# EAGLE design step_motor (EAGLE 6.5.0)
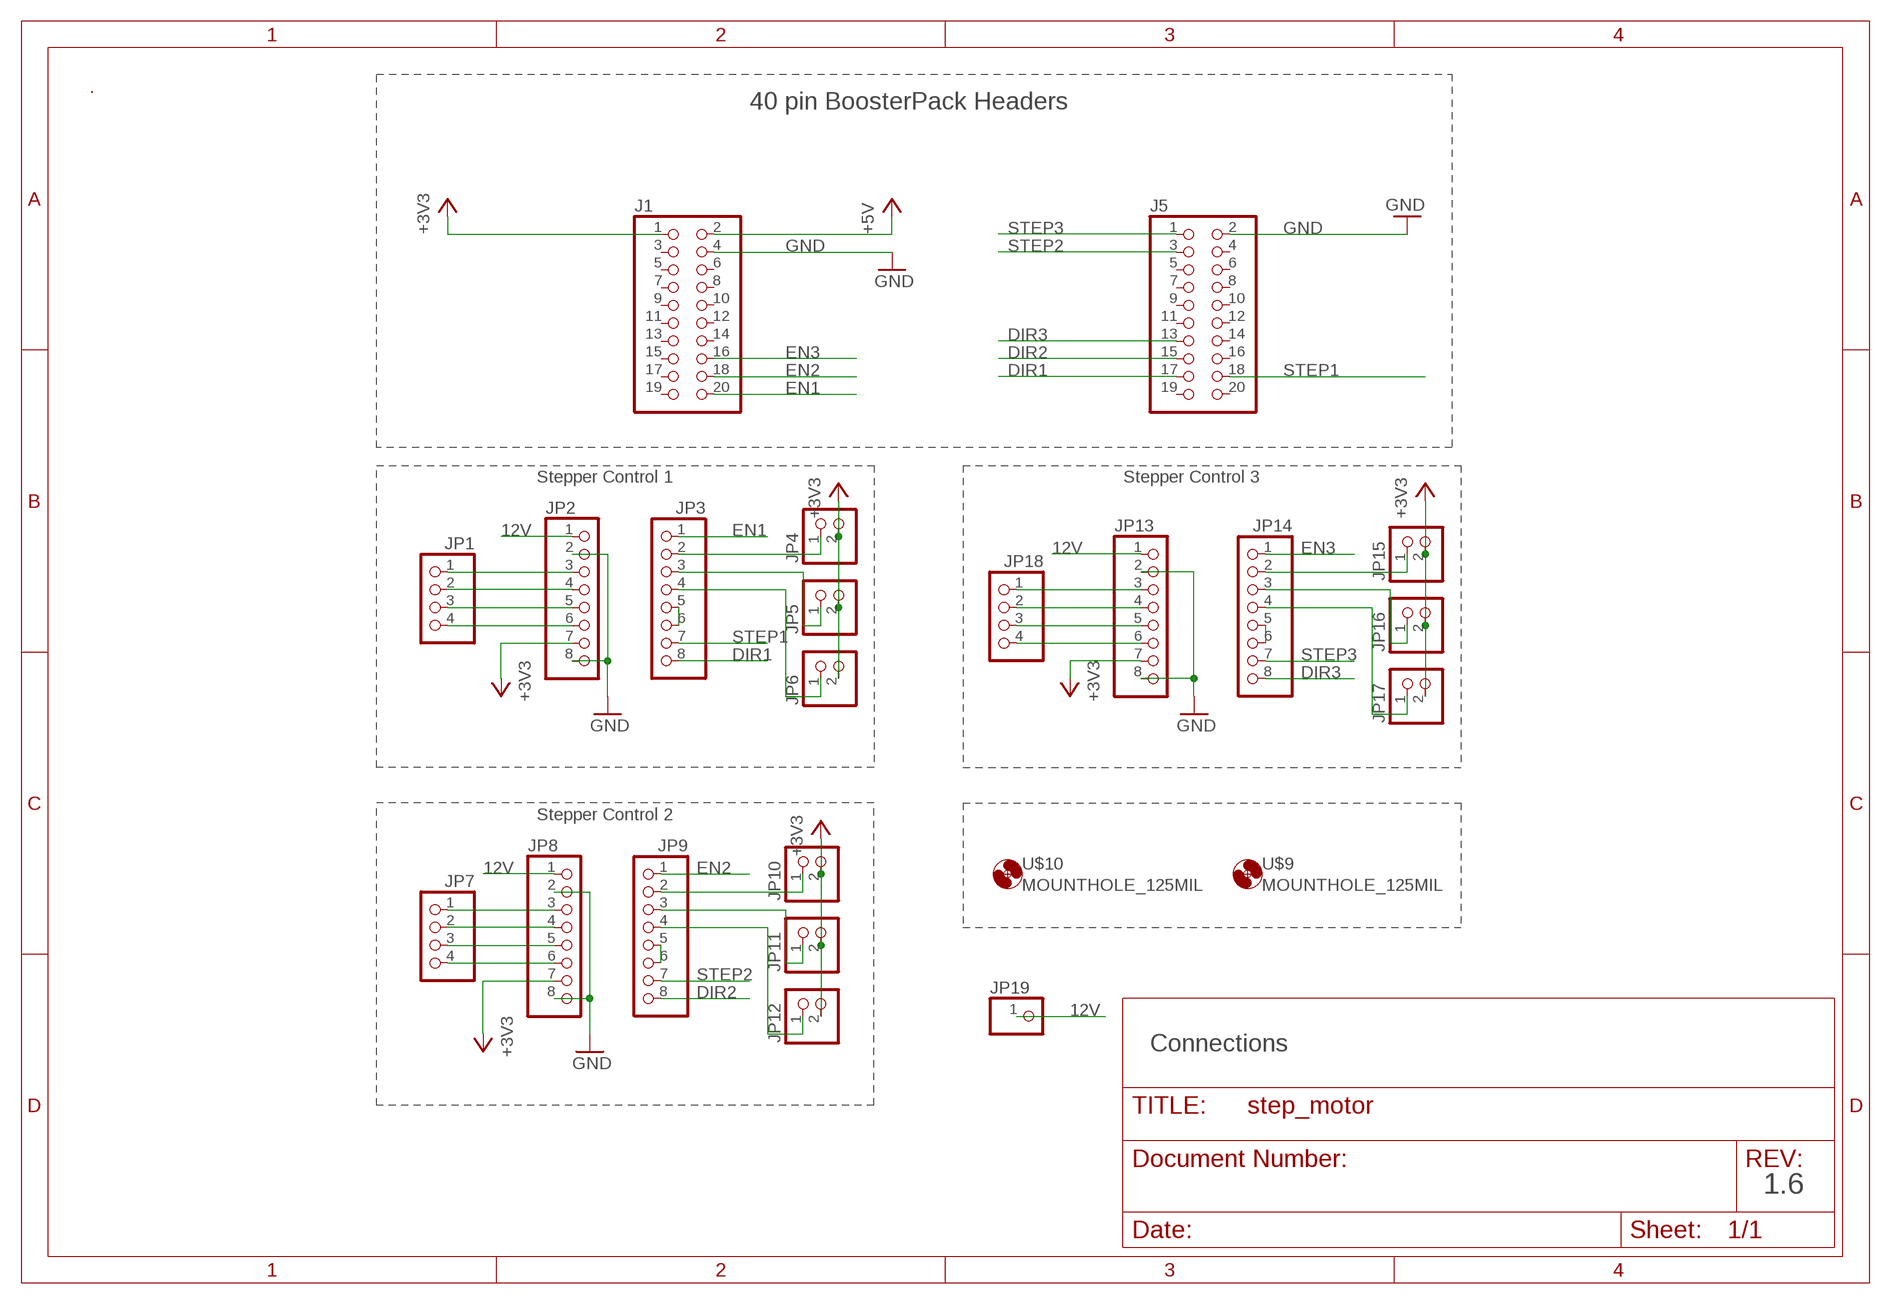
[diagram p0: schematic, sheet 1]

## Parts
J1  PINHD-2X10  [2X10]
J5  PINHD-2X10  [2X10]
JP1  PINHD-1X4  [1X04]
JP2  PINHD-1X8  [1X08]
JP3  PINHD-1X8  [1X08]
JP4  PINHD-1X2  [1X02]
JP5  PINHD-1X2  [1X02]
JP6  PINHD-1X2  [1X02]
JP7  PINHD-1X4  [1X04]
JP8  PINHD-1X8  [1X08]
JP9  PINHD-1X8  [1X08]
JP10  PINHD-1X2  [1X02]
JP11  PINHD-1X2  [1X02]
JP12  PINHD-1X2  [1X02]
JP13  PINHD-1X8  [1X08]
JP14  PINHD-1X8  [1X08]
JP15  PINHD-1X2  [1X02]
JP16  PINHD-1X2  [1X02]
JP17  PINHD-1X2  [1X02]
JP18  PINHD-1X4  [1X04]
JP19  PINHD-1X1  [1X01]
U$4  MS_TM  [MS_TM]
U$9  MOUNTHOLE_125MIL  [MOUNTHOLE_125MIL]
U$10  MOUNTHOLE_125MIL  [MOUNTHOLE_125MIL]

## Nets
12V: JP2.1 JP8.1 JP13.1 JP19.1
+5V [Power]: J1.2
DIR1: J5.17 JP3.8
DIR2: J5.15 JP9.8
DIR3: J5.13 JP14.8
EN1: J1.20 JP3.1
EN2: J1.18 JP9.1
EN3: J1.16 JP14.1
GND [Ground]: J1.4 J5.2 JP2.2 JP2.8 JP8.2 JP8.8 JP13.2 JP13.8
N$1: JP1.1 JP2.3
N$2: JP1.2 JP2.4
N$3: JP1.3 JP2.5
N$4: JP1.4 JP2.6
N$5: JP3.5 JP3.6
N$6: JP3.2 JP4.1
N$7: JP3.3 JP5.1
N$8: JP3.4 JP6.1
N$10: JP9.2 JP10.1
N$11: JP9.3 JP11.1
N$12: JP9.4 JP12.1
N$13: JP7.1 JP8.3
N$14: JP7.2 JP8.4
N$15: JP9.5 JP9.6
N$16: JP7.3 JP8.5
N$17: JP7.4 JP8.6
N$18: JP14.2 JP15.1
N$19: JP14.3 JP16.1
N$20: JP14.4 JP17.1
N$28: JP14.5 JP14.6
N$31: JP13.3 JP18.1
N$32: JP13.4 JP18.2
N$35: JP13.5 JP18.3
N$36: JP13.6 JP18.4
STEP1: J5.18 JP3.7
STEP2: J5.3 JP9.7
STEP3: J5.1 JP14.7
VCC2: J1.1 JP2.7 JP4.2 JP5.2 JP6.2 JP8.7 JP10.2 JP11.2 JP12.2 JP13.7 JP15.2 JP16.2 JP17.2 ; supply symbol labelled +3V3
Unconnected: J1.3 J1.5 J1.6 J1.7 J1.8 J1.9 J1.10 J1.11 J1.12 J1.13 J1.14 J1.15 J1.17 J1.19 J5.4 J5.5 J5.6 J5.7 J5.8 J5.9 J5.10 J5.11 J5.12 J5.14 J5.16 J5.19 J5.20

## Notes on the sheet
- 40 pin BoosterPack Headers
- Stepper Control 1 | Stepper Control 3
- Stepper Control 2
- Connections
- 1.6

## Library data of the parts
J1 J5 = pinhead:PINHD-2X10: PIN HEADER
JP1 JP7 JP18 = pinhead:PINHD-1X4: PIN HEADER
JP2 JP3 JP8 JP9 JP13 JP14 = pinhead:PINHD-1X8: PIN HEADER
JP4-JP6 JP10-JP12 JP15-JP17 = pinhead:PINHD-1X2: PIN HEADER
JP19 = pinhead:PINHD-1X1: PIN HEADER
U$4 = LP_Silkscreen:MS_TM
U$9 U$10 = MSP-EXP432:MOUNTHOLE_125MIL

## Net classes
0 Default: width 0.203 mm, drill 0.838 mm, clearance 0.254 mm
1 Ground: width 0.203 mm, drill 0.838 mm, clearance 0.254 mm to class 0, clearance 0.152 mm
2 Power: width 0.381 mm, drill 0.838 mm, clearance 0.254 mm to class 0, clearance 0.152 mm to class 1, clearance 0.152 mm

## Board
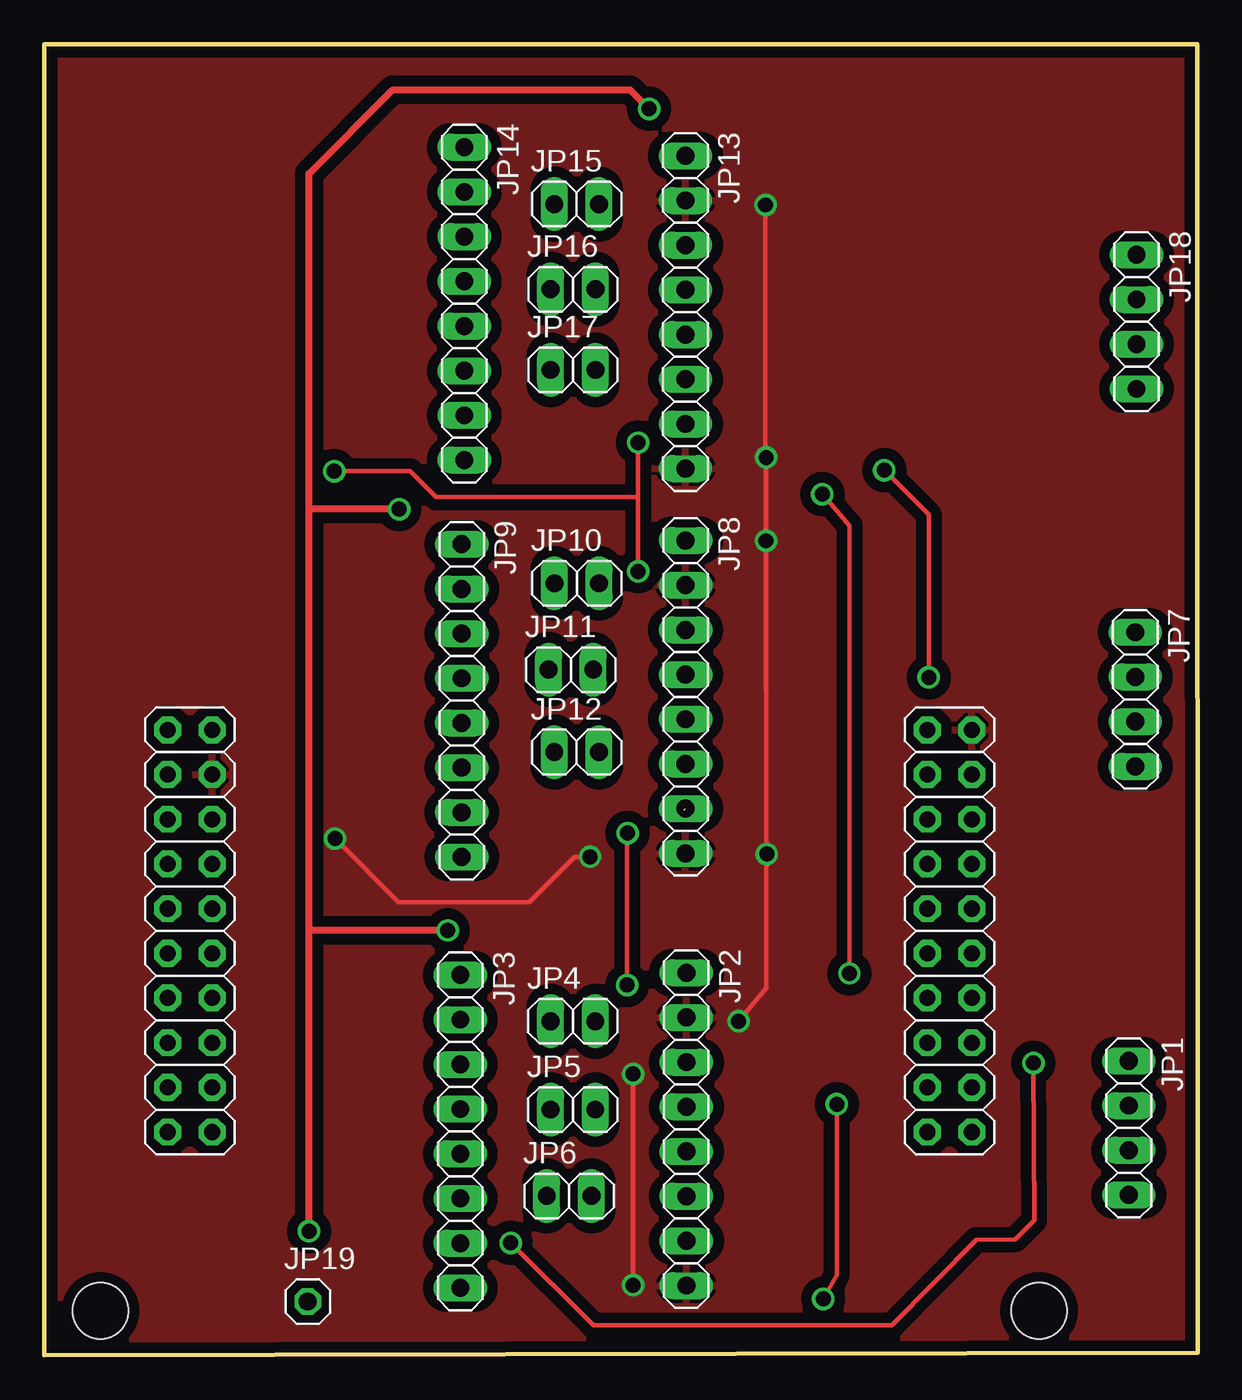
[diagram p1: board, top side]
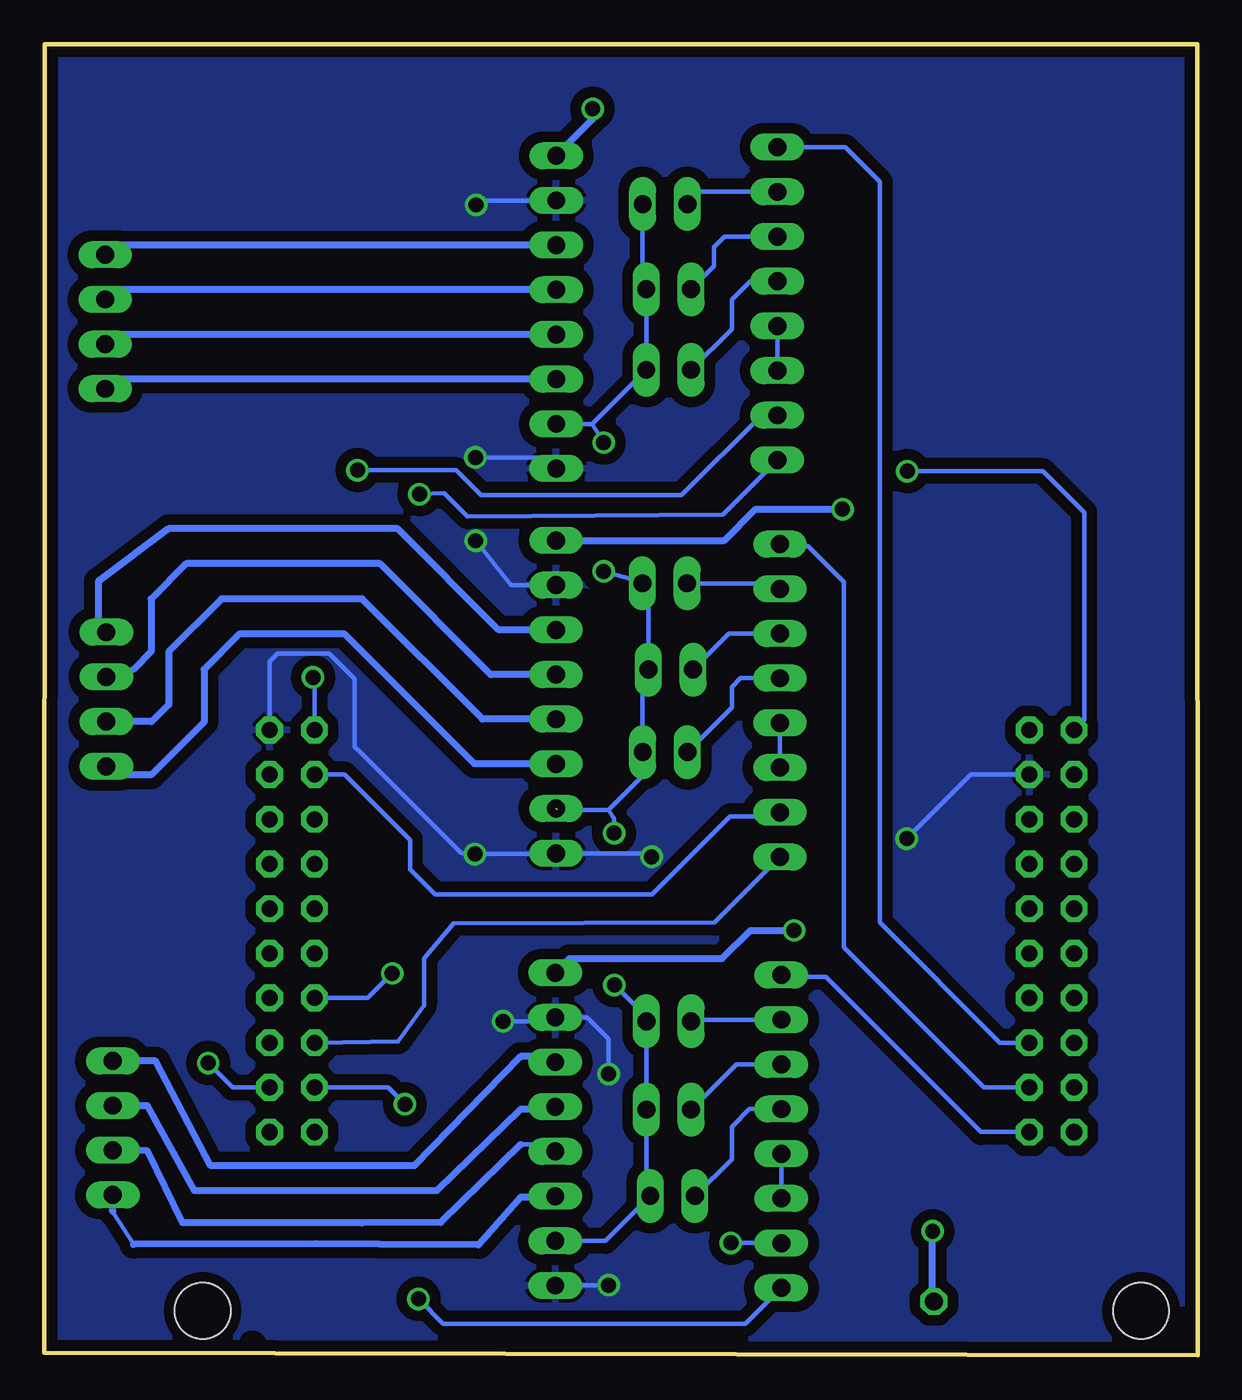
[diagram p2: board, bottom side, seen from below]

Size 65.58 x 74.55 mm. Coordinates in mm from the lower left corner, seen from the top.
Outline: 0.02,74.48 0,0 65.58,0.15 65.55,74.55 0.02,74.55
Copper layers (1*16): Top 0.0178mm / dielectric 12mil / Bottom 0.0178mm
Design rules "default": minimum track width 6mil, minimum drill 12mil, track to track 6mil, track to pad 6mil, pad to pad 6mil, via to via 8mil, smd to smd 6mil, copper to edge 8mil, drill to drill 8mil, minimum pad ring 10mil, minimum via ring 8mil, stop-mask expansion 8mil, vias tented up to drill 15mil, thermal gap 8mil

### Footprints (pad centres in the part's own frame; a part is rotated, then mirrored left to right if it is on the bottom)
2X10 = drill 0.914 pad 1.524 octagon: 1 -11.43,-1.27; 2 -11.43,1.27; 3 -8.89,-1.27; 4 -8.89,1.27; 5 -6.35,-1.27; 6 -6.35,1.27; 7 -3.81,-1.27; 8 -3.81,1.27; 9 -1.27,-1.27; 10 -1.27,1.27; 11 1.27,-1.27; 12 1.27,1.27; 13 3.81,-1.27; 14 3.81,1.27; 15 6.35,-1.27; 16 6.35,1.27; 17 8.89,-1.27; 18 8.89,1.27; 19 11.43,-1.27; 20 11.43,1.27
1X04 = drill 1.016 long: 1 -3.81,0; 2 -1.27,0; 3 1.27,0; 4 3.81,0
1X08 = drill 1.016 long: 1 -8.89,0; 2 -6.35,0; 3 -3.81,0; 4 -1.27,0; 5 1.27,0; 6 3.81,0; 7 6.35,0; 8 8.89,0
1X02 = drill 1.016 long: 1 -1.27,0; 2 1.27,0
1X01 = drill 1.016 octagon: 1 0,0
MOUNTHOLE_125MIL = hole 3.175: 0,0

### Placement (x,y rotation side)
J1  8.29,24.13 270 top
J5  51.47,24.13 270 top
JP1  61.66,12.93 270 top
JP2  36.51,12.86 270 top
JP3  23.67,12.74 270 top
JP4  30.07,19 0 top
JP5  30.07,13.98 0 top
JP6  29.85,9.07 0 top
JP7  62.03,37.3 270 top
JP8  36.47,37.44 270 top
JP9  23.75,37.22 270 top
JP10  30.29,43.89 0 top
JP11  29.95,38.98 0 top
JP12  30.28,34.3 0 top
JP13  36.46,59.3 270 top
JP14  23.89,59.79 270 top
JP15  30.28,65.45 0 top
JP16  30.07,60.6 0 top
JP17  30.07,56.02 0 top
JP18  62.1,58.76 270 top
JP19  15,3.07 0 top
U$4  53.4,0.36 0 top
U$9  56.55,2.54 0 top
U$10  3.21,2.54 0 top

### Tracks (layer width: path | path; a pad name or v marks a point on that pad's centre or on a via)
12V  (via drill 0.85)
  Top 0.406: v15.07,7.07 15.07,24.16 | 15.07,24.16 15.07,48.11 | 15.07,48.11 15.07,67.18 19.82,71.93 33.32,71.93 v34.39,70.86 | v22.95,24.16 15.07,24.16 | v20.19,48.11 15.07,48.11
  Bottom 0.254: JP19.1 15.07,3.14 | JP8.1
  Bottom 0.406: 15.07,3.14 v15.07,7.07 | v34.39,70.86 34.39,70.26 JP13.1 | JP2.1 35.71,22.56 27.03,22.56 25.43,24.16 v22.95,24.16 | JP8.1 26.91,46.33 25.13,48.11 v20.19,48.11
DIR1  (via drill 0.85)
  Top 0.254: v44.29,3.22 45.06,4.58 v45.06,14.29
  Bottom 0.254: JP3.8 25.7,1.81 42.89,1.81 v44.29,3.22 | v45.06,14.29 46.02,15.24 J5.17
DIR2
  Bottom 0.254: JP9.8 27.48,24.61 42.31,24.56 43.98,22.56 43.98,19.9 45.44,17.86 J5.15
DIR3  (via drill 0.85)
  Top 0.254: v44.24,48.96 45.78,47.18 v45.78,21.72
  Bottom 0.254: JP14.8 26.98,47.81 41.5,47.69 42.83,49.02 v44.24,48.96 | v45.78,21.72 47.18,20.32 J5.13
EN1
  Bottom 0.254: J1.20 12.31,12.7 21.13,21.52 23.56,21.52 JP3.1
EN2
  Bottom 0.254: J1.18 12.16,15.24 20.11,23.18 20.11,43.97 22.15,46.01 23.64,46.01 JP9.1
EN3
  Bottom 0.254: J1.16 11.24,17.78 18.06,24.61 18.06,66.71 20.02,68.67 23.88,68.67 JP14.1
GND  (via drill 0.85)
  Top 0.254: v33.48,4 v33.48,16 | v39.48,19 41.07,20.9 41.07,27.9 v41.08,28.5 41.06,29.11 v41.04,46.31 41.04,50.37 v41.05,51.04 41.02,51.89 v41.02,65.4 | v16.54,29.38 20.17,25.76 27.56,25.76 30.15,28.35 v31.04,28.35
  Bottom 0.254: JP2.8 36.49,4 v33.48,4 | v33.48,16 33.48,18 34.7,19.21 JP2.2 36.73,19 v39.48,19 | JP8.2 39.04,43.79 v41.04,46.31 | v41.05,51.04 37.46,51.04 JP13.8 | JP13.2 40.76,65.65 v41.02,65.4 | J5.2 52.74,39.44 52.29,39.9 49.36,39.9 47.92,38.46 47.92,34.6 47.68,34.35 41.87,28.57 v41.08,28.5 36.61,28.5 36.51,28.5 JP8.8 31.24,28.55 v31.04,28.35 | J1.4 12.9,33.02 v16.54,29.38
  pour Bottom (isolate 0.61): 66.15,74.51 66.15,-0.96 -0.2,-1.09 -0.2,74.49
  pour Top (isolate 0.61): 65.66,74.58 65.66,-0.89 0.01,-0.89 0.01,74.41
N$1
  Bottom 0.254: JP2.3 36.84,17
  Bottom 0.406: 36.84,17 38.48,17 44.53,10.79 45.53,10.79 48.1,10.79 56.1,10.79 59.23,16.74 JP1.1
N$2
  Bottom 0.254: JP2.4 36.65,14
  Bottom 0.406: 36.65,14 38.48,14 43.26,9.37 46.26,9.37 49.02,9.37 57.02,9.37 59.69,14.2 JP1.2
N$3
  Bottom 0.254: JP2.5 36.92,12 38.48,12
  Bottom 0.406: 38.48,12 43.02,7.57 47.52,7.54 48.89,7.54 57.71,7.54 59.69,11.62 JP1.3
N$4
  Bottom 0.254: JP2.6 36.57,9 | 60.48,6.32 61.66,8.18
  Bottom 0.406: 36.57,9 38.48,9 40.88,6.28 46.51,6.33 50.12,6.36 60.48,6.32 | 61.66,8.18 JP1.4
N$5
  Bottom 0.254: JP3.5 JP3.6
N$6
  Bottom 0.254: JP3.2 28.8,19.09 JP4.1
N$7
  Bottom 0.254: JP3.3 26.23,16.55 JP5.1
N$8
  Bottom 0.254: JP3.4 25.48,14.01 26.48,13 26.48,11.16 JP6.1
N$10
  Bottom 0.254: JP9.2 24.06,43.89 JP10.1
N$11
  Bottom 0.254: JP9.3 26.63,41.03 JP11.1
N$12
  Bottom 0.254: JP9.4 25.99,38.49 26.48,38 26.48,36.82 JP12.1
N$13
  Bottom 0.254: 62.48,41.56 JP7.1
  Bottom 0.406: JP8.3 39.73,41.25 45.48,47 58.48,47 62.48,44 62.48,41.56
N$14
  Bottom 0.254: 60.48,39 61.6,39
  Bottom 0.406: JP8.4 40.19,38.71 46.48,45 57.48,45 59.48,43 59.48,40 60.48,39 | 61.6,39 JP7.2
N$15
  Bottom 0.254: JP9.5 JP9.6
N$16
  Bottom 0.406: JP8.5 40.65,36.17 47.48,43 55.48,43 58.48,40 58.48,37 59.46,36.03 JP7.3
N$17
  Bottom 0.254: 61.55,33 JP7.4
  Bottom 0.406: JP8.6 41.11,33.63 48.48,41 54.48,41 56.48,39 56.48,36 59.48,33 61.55,33
N$18
  Bottom 0.254: JP14.2 28.32,66.14 JP15.1
N$19
  Bottom 0.254: JP14.3 26.89,63.6 27.48,63 27.48,61.92 JP16.1
N$20
  Bottom 0.254: JP14.4 25.43,61.06 26.48,60 26.48,58.34 JP17.1
N$28
  Bottom 0.254: JP14.5 JP14.6
N$31
  Bottom 0.406: JP13.3 61.56,63.11 JP18.1
N$32
  Bottom 0.406: JP13.4 61.56,60.57 JP18.2
N$35
  Bottom 0.406: JP13.5 61.56,58.03 JP18.3
N$36
  Bottom 0.406: JP13.6 61.56,55.49 JP18.4
STEP1  (via drill 0.85)
  Top 0.254: v26.53,6.4 31.22,1.71 48.2,1.71 53,6.57 55.22,6.61 56.28,7.68 v56.25,16.63
  Bottom 0.254: JP3.7 23.68,6.4 v26.53,6.4 | v56.25,16.63 54.85,15.24 J5.18
STEP2
  Bottom 0.254: JP9.7 23.97,30.65 26.58,30.65 31.03,26.2 43.36,26.2 44.78,27.62 44.78,29.31 48.49,33.02 J5.3
STEP3  (via drill 0.85)
  Top 0.254: v47.76,50.32 50.29,47.79 v50.29,38.54
  Bottom 0.254: JP14.7 23.93,53.4 24.83,53.4 29.33,48.9 40.73,48.9 42.15,50.32 v47.76,50.32 | v50.29,38.54 50.2,38.46 J5.1
VCC2  (via drill 0.85)  (1 unrouted)
  Top 0.254: v33.77,51.89 33.77,48.78 | 33.77,48.78 v33.77,44.57 | v33.17,29.69 33.15,29.49 v33.15,21.05 | v16.5,50.26 20.82,50.26 22.3,48.78 33.77,48.78
  Bottom 0.254: JP15.2 31.55,60.81 JP16.2 JP17.2 | JP17.2 | JP17.2 34.41,52.95 | 33.48,31 31.55,32.94 JP12.2 31.55,38.66 JP11.2 31.22,43.55 JP10.2 31.56,43.97 v33.77,44.57 | 33.48,31 36.38,31 | JP2.7 33.67,6.51 JP6.2 31.34,9.29 JP5.2 JP4.2 31.34,19.24 v33.15,21.05 | 34.41,52.95 JP13.7 | 34.41,52.95 33.77,51.95 v33.77,51.89 | 33.48,31 33.17,30.52 v33.17,29.69 | J1.1 6.46,36.13 6.46,47.92 8.8,50.26 v16.5,50.26